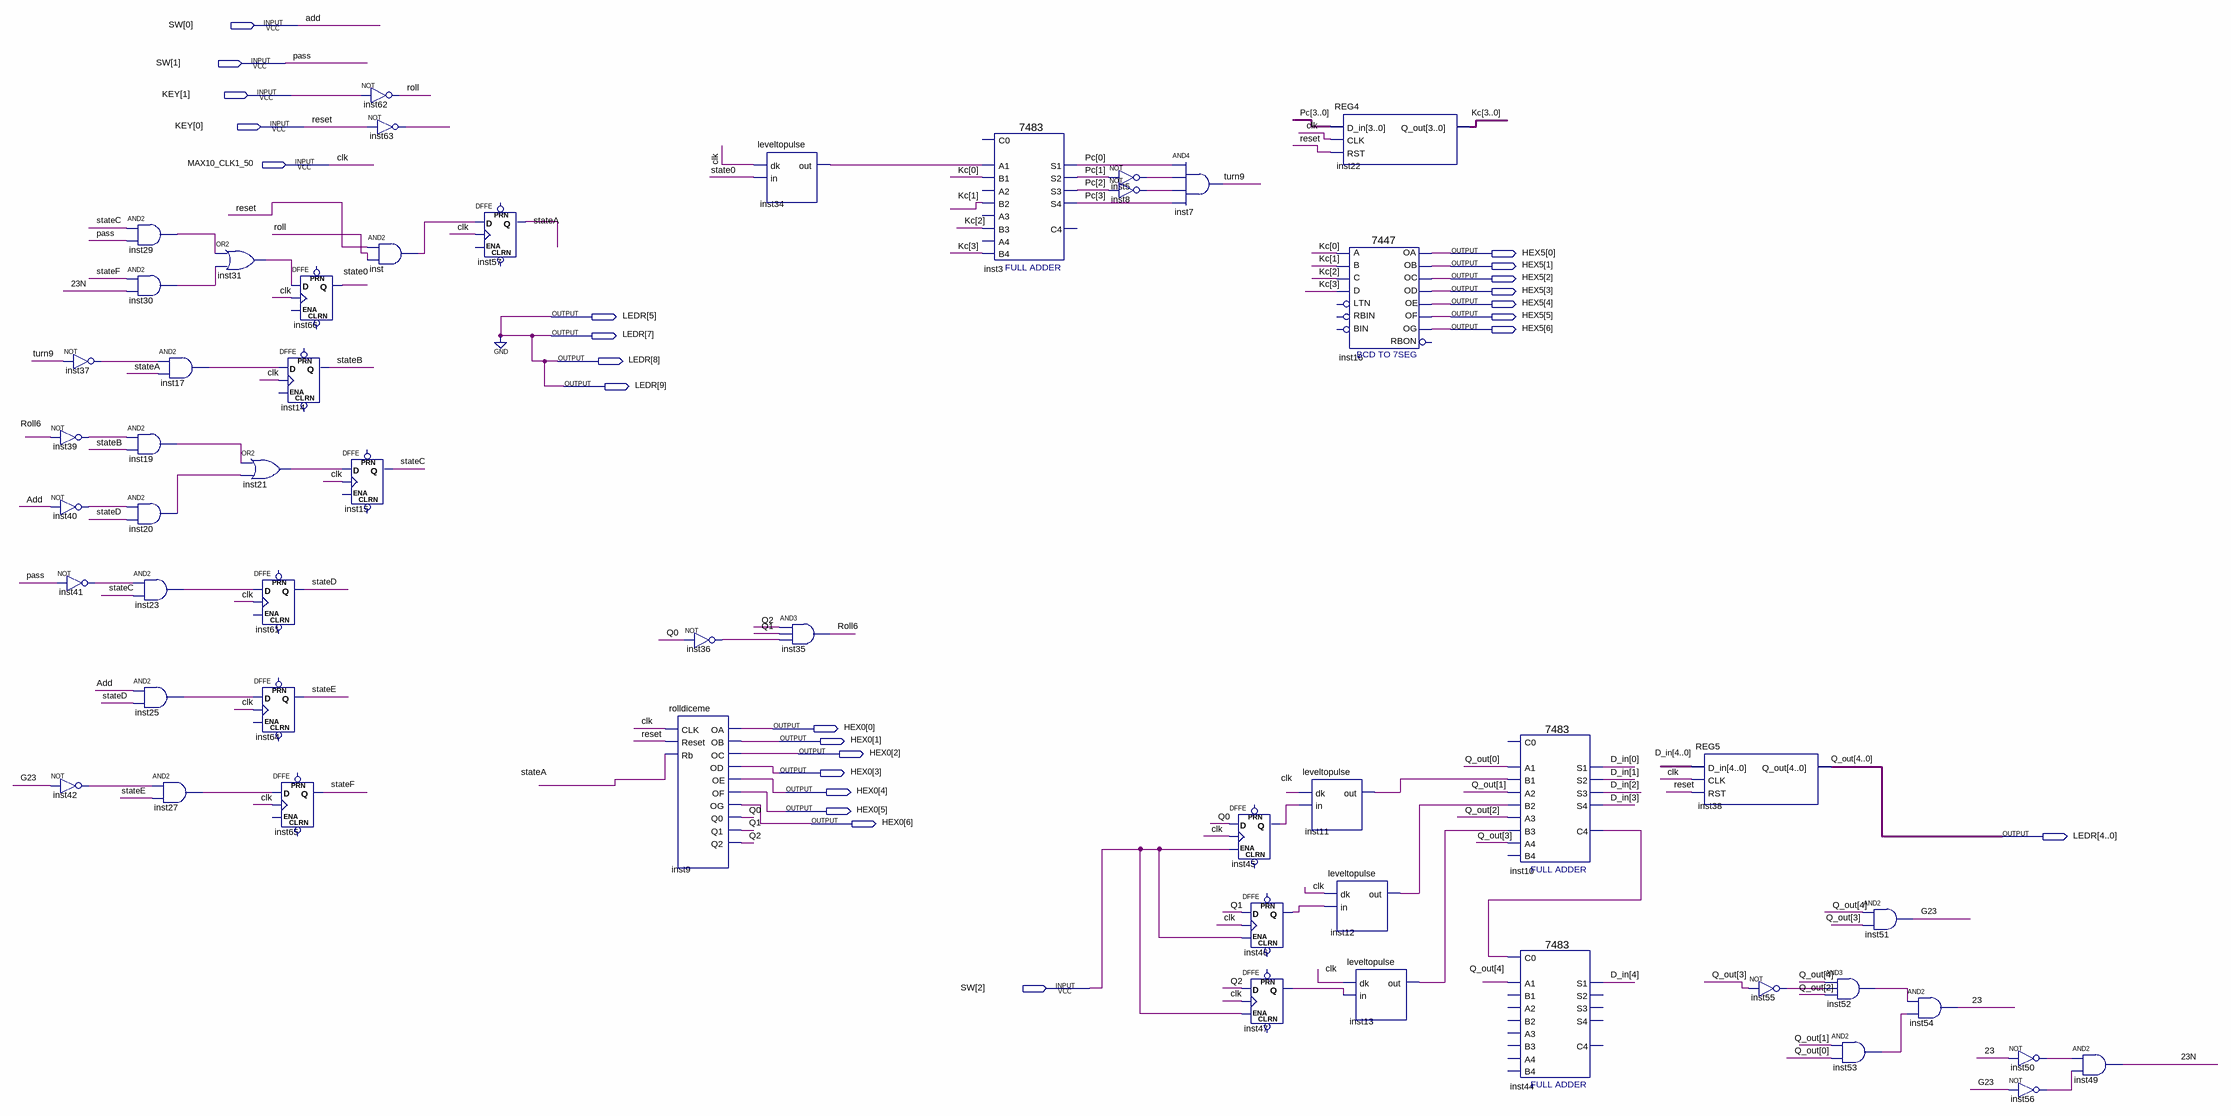
[diagram p0: schematic sheet]
// Quartus schematic lab6Design.bdf as structural Verilog: 52 symbols, 25 pins
module lab6Design (
  input  [2:0] SW,
  input  [1:0] KEY,
  input  MAX10_CLK1_50,
  output [6:0] HEX5,
  output [9:0] LEDR,
  output [6:0] HEX0
);

  wire \23 , \23N , G23, inst5_out, inst8_out, inst10_c4, inst11_out, inst12_out, inst13_out, inst17_out,
       inst19_out, inst20_out, inst21_out, inst23_out, inst25_out, inst27_out, inst29_out, inst30_out,
       inst31_out, inst34_out, inst36_out, inst37_out, inst39_out, inst40_out, inst41_out, inst42_out,
       inst45_q, inst46_q, inst47_q, inst50_out, inst52_out, inst53_out, inst55_out, inst56_out, inst63_out,
       inst_out, Q0, Q1, Q2, roll, Roll6, state0, stateA, stateB, stateC, stateD, stateE, stateF, turn9;
  wire [3:0] Kc, Pc;
  wire [4:0] D_in;

  not inst37 (inst37_out, turn9);
  not inst39 (inst39_out, Roll6);
  not inst40 (inst40_out, SW[0]);
  not inst41 (inst41_out, SW[1]);
  not inst42 (inst42_out, G23);
  and inst29 (inst29_out, stateC, SW[1]);
  and inst30 (inst30_out, stateF, \23N );
  and inst19 (inst19_out, inst39_out, stateB);
  and inst20 (inst20_out, inst40_out, stateD);
  and inst23 (inst23_out, inst41_out, stateC);
  and inst25 (inst25_out, SW[0], stateD);
  and inst17 (inst17_out, inst37_out, stateA);
  and inst27 (inst27_out, inst42_out, stateE);
  or inst31 (inst31_out, inst29_out, inst30_out);
  or inst21 (inst21_out, inst19_out, inst20_out);
  DFFE inst66 (.D(inst31_out), .CLK(MAX10_CLK1_50), .Q(state0));  // open: PRN, CLRN, ENA
  DFFE inst14 (.D(inst17_out), .CLK(MAX10_CLK1_50), .Q(stateB));  // open: PRN, CLRN, ENA
  DFFE inst61 (.D(inst23_out), .CLK(MAX10_CLK1_50), .Q(stateD));  // open: PRN, CLRN, ENA
  DFFE inst64 (.D(inst25_out), .CLK(MAX10_CLK1_50), .Q(stateE));  // open: PRN, CLRN, ENA
  DFFE inst65 (.D(inst27_out), .CLK(MAX10_CLK1_50), .Q(stateF));  // open: PRN, CLRN, ENA
  DFFE inst15 (.D(inst21_out), .CLK(MAX10_CLK1_50), .Q(stateC));  // open: PRN, CLRN, ENA
  not inst62 (roll, KEY[1]);
  not inst63 (inst63_out, KEY[0]);
  and inst (inst_out, KEY[0], roll);
  DFFE inst57 (.D(inst_out), .CLK(MAX10_CLK1_50), .Q(stateA));  // open: PRN, CLRN, ENA
  not inst36 (inst36_out, Q0);
  rolldiceme inst9 (
    .CLK(MAX10_CLK1_50), .Reset(KEY[0]), .Rb(stateA), .OA(HEX0[0]), .OB(HEX0[1]), .OC(HEX0[2]), .OD(HEX0[3]),
    .OE(HEX0[4]), .OF(HEX0[5]), .OG(HEX0[6]), .Q0(Q0), .Q1(Q1), .Q2(Q2));
  leveltopulse inst34 (.dk(MAX10_CLK1_50), .in(state0), .out(inst34_out));
  and inst35 (Roll6, Q2, Q1, inst36_out);
  \7483  inst3 (
    .B4(Kc[3]), .A1(inst34_out), .B1(Kc[0]), .B2(Kc[1]), .B3(Kc[2]), .S3(Pc[2]), .S4(Pc[3]), .S2(Pc[1]),
    .S1(Pc[0]));  // open: C0, A2, A3, A4, C4
  not inst5 (inst5_out, Pc[1]);
  not inst8 (inst8_out, Pc[2]);
  and inst7 (turn9, Pc[0], inst5_out, inst8_out, Pc[3]);
  DFFE inst45 (.D(Q0), .CLK(MAX10_CLK1_50), .ENA(SW[2]), .Q(inst45_q));  // open: PRN, CLRN
  DFFE inst46 (.D(Q1), .CLK(MAX10_CLK1_50), .ENA(SW[2]), .Q(inst46_q));  // open: PRN, CLRN
  DFFE inst47 (.D(Q2), .CLK(MAX10_CLK1_50), .ENA(SW[2]), .Q(inst47_q));  // open: PRN, CLRN
  leveltopulse inst11 (.dk(MAX10_CLK1_50), .in(inst45_q), .out(inst11_out));
  REG4 inst22 (.D_in(Pc), .CLK(MAX10_CLK1_50), .RST(KEY[0]), .Q_out(Kc));
  \7447  inst16 (
    .B(Kc[1]), .C(Kc[2]), .D(Kc[3]), .A(Kc[0]), .OB(HEX5[1]), .OC(HEX5[2]), .OE(HEX5[4]), .OD(HEX5[3]),
    .OF(HEX5[5]), .OG(HEX5[6]), .OA(HEX5[0]));  // open: LTN, RBIN, BIN, RBON
  leveltopulse inst12 (.dk(MAX10_CLK1_50), .in(inst46_q), .out(inst12_out));
  leveltopulse inst13 (.dk(MAX10_CLK1_50), .in(inst47_q), .out(inst13_out));
  \7483  inst10 (
    .A1(LEDR[0]), .A2(LEDR[1]), .B1(inst11_out), .B2(inst12_out), .A3(LEDR[2]), .B3(inst13_out),
    .A4(LEDR[3]), .S3(D_in[2]), .S4(D_in[3]), .S2(D_in[1]), .C4(inst10_c4), .S1(D_in[0]));  // open: B4, C0
  \7483  inst44 (.C0(inst10_c4), .A1(LEDR[4]), .S1(D_in[4]));  // open: B4, A2, B1, B2, A3, B3, A4, S3, S4, S2, C4
  REG5 inst38 (.D_in(D_in), .CLK(MAX10_CLK1_50), .RST(KEY[0]), .Q_out(LEDR[4:0]));
  not inst55 (inst55_out, LEDR[3]);
  and inst51 (G23, LEDR[4], LEDR[3]);
  and inst52 (inst52_out, LEDR[4], inst55_out, LEDR[2]);
  and inst53 (inst53_out, LEDR[1], LEDR[0]);
  and inst54 (\23 , inst52_out, inst53_out);
  not inst50 (inst50_out, \23 );
  not inst56 (inst56_out, G23);
  and inst49 (\23N , inst50_out, inst56_out);

  assign {LEDR[9:7], LEDR[5]} = 4'b0000;

  // Other names for the same wires on the sheet: Add = SW[0]; clk = MAX10_CLK1_50; pass = SW[1];
  //   Q_out[4:0] = LEDR[4:0]; reset = KEY[0]
endmodule
